# Altium schematic sheet DP&SDI_Arria10.SchDoc: DP & SDI
size B; DocumentNumber: 22; SheetNumber: 22; SheetTotal: 46
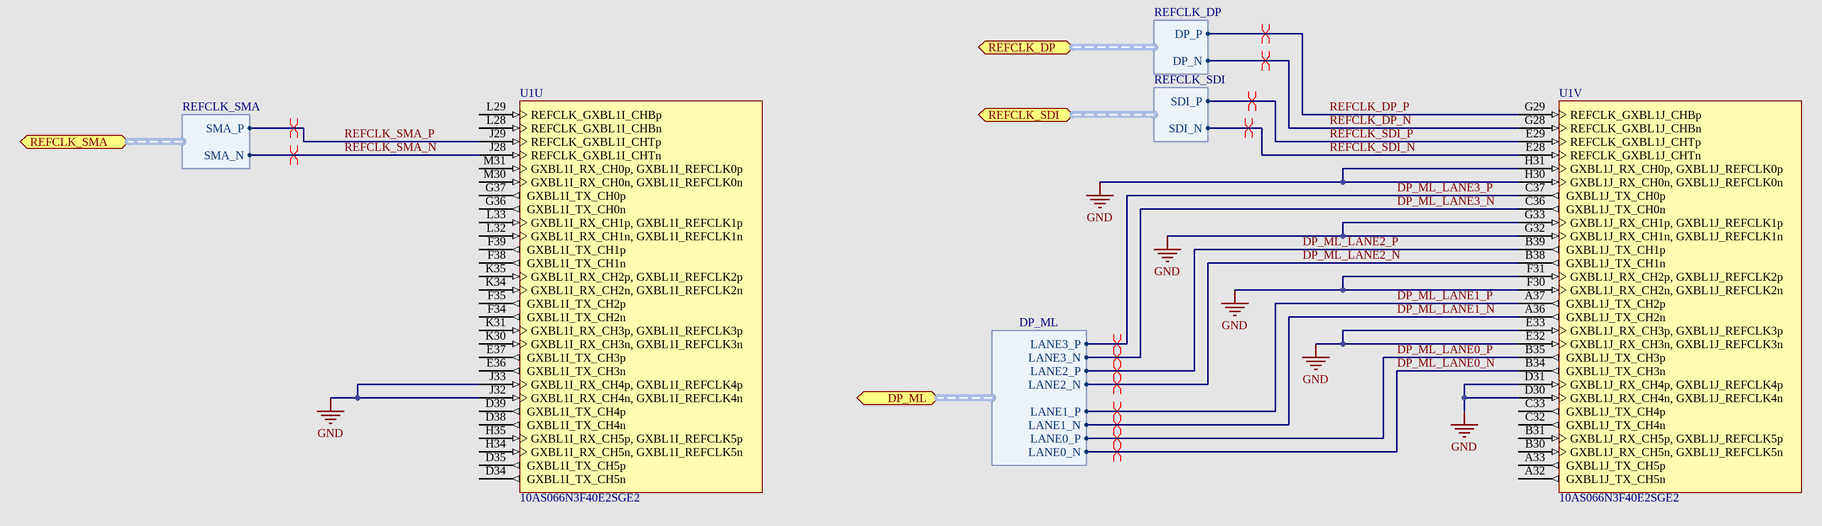
[diagram p0: DP&SDI_Arria10.SchDoc]

## Parts
U1  10AS066N3F40E2SGE2  [ALTR-FBGA1517_A-350]  (parts U,V of 31)

## Ports
DP_ML (harness DP_ML), REFCLK_DP (harness REFCLK_DP), REFCLK_SDI (harness REFCLK_SDI), REFCLK_SMA (harness REFCLK_SMA)

## Harnesses
REFCLK_SMA: SMA_P, SMA_N
REFCLK_DP: DP_P, DP_N
REFCLK_SDI: SDI_P, SDI_N
DP_ML: LANE2_N, LANE2_P, LANE3_N, LANE3_P, LANE1_P, LANE1_N, LANE0_P, LANE0_N

## Nets
GND: U1.D30(GXBL1J_RX_CH4n,_GXBL1J_REFCLK4n) U1.D31(GXBL1J_RX_CH4p,_GXBL1J_REFCLK4p) U1.E32(GXBL1J_RX_CH3n,_GXBL1J_REFCLK3n) U1.E33(GXBL1J_RX_CH3p,_GXBL1J_REFCLK3p) U1.F30(GXBL1J_RX_CH2n,_GXBL1J_REFCLK2n) U1.F31(GXBL1J_RX_CH2p,_GXBL1J_REFCLK2p) U1.G32(GXBL1J_RX_CH1n,_GXBL1J_REFCLK1n) U1.G33(GXBL1J_RX_CH1p,_GXBL1J_REFCLK1p) U1.H30(GXBL1J_RX_CH0n,_GXBL1J_REFCLK0n) U1.H31(GXBL1J_RX_CH0p,_GXBL1J_REFCLK0p) U1.J32(GXBL1I_RX_CH4n,_GXBL1I_REFCLK4n) U1.J33(GXBL1I_RX_CH4p,_GXBL1I_REFCLK4p)
DP_ML_LANE0_N: U1.B34(GXBL1J_TX_CH3n) ; port DP_ML.LANE0_N
DP_ML_LANE0_P: U1.B35(GXBL1J_TX_CH3p) ; port DP_ML.LANE0_P
DP_ML_LANE1_N: U1.A36(GXBL1J_TX_CH2n) ; port DP_ML.LANE1_N
DP_ML_LANE1_P: U1.A37(GXBL1J_TX_CH2p) ; port DP_ML.LANE1_P
DP_ML_LANE2_N: U1.B38(GXBL1J_TX_CH1n) ; port DP_ML.LANE2_N
DP_ML_LANE2_P: U1.B39(GXBL1J_TX_CH1p) ; port DP_ML.LANE2_P
DP_ML_LANE3_N: U1.C36(GXBL1J_TX_CH0n) ; port DP_ML.LANE3_N
DP_ML_LANE3_P: U1.C37(GXBL1J_TX_CH0p) ; port DP_ML.LANE3_P
REFCLK_DP_N: U1.G28(REFCLK_GXBL1J_CHBn) ; port REFCLK_DP.DP_N
REFCLK_DP_P: U1.G29(REFCLK_GXBL1J_CHBp) ; port REFCLK_DP.DP_P
REFCLK_SDI_N: U1.E28(REFCLK_GXBL1J_CHTn) ; port REFCLK_SDI.SDI_N
REFCLK_SDI_P: U1.E29(REFCLK_GXBL1J_CHTp) ; port REFCLK_SDI.SDI_P
REFCLK_SMA_N: U1.J28(REFCLK_GXBL1I_CHTn) ; port REFCLK_SMA.SMA_N
REFCLK_SMA_P: U1.J29(REFCLK_GXBL1I_CHTp) ; port REFCLK_SMA.SMA_P

Not connected (* = marked no-connect by the designer): U1 A32(GXBL1J_TX_CH5n) A33(GXBL1J_TX_CH5p) B30(GXBL1J_RX_CH5n,_GXBL1J_REFCLK5n) B31(GXBL1J_RX_CH5p,_GXBL1J_REFCLK5p) C32(GXBL1J_TX_CH4n) C33(GXBL1J_TX_CH4p) D34(GXBL1I_TX_CH5n) D35(GXBL1I_TX_CH5p) D38(GXBL1I_TX_CH4n) D39(GXBL1I_TX_CH4p) E36(GXBL1I_TX_CH3n) E37(GXBL1I_TX_CH3p) F34(GXBL1I_TX_CH2n) F35(GXBL1I_TX_CH2p) F38(GXBL1I_TX_CH1n) F39(GXBL1I_TX_CH1p) G36(GXBL1I_TX_CH0n) G37(GXBL1I_TX_CH0p) H34(GXBL1I_RX_CH5n,_GXBL1I_REFCLK5n) H35(GXBL1I_RX_CH5p,_GXBL1I_REFCLK5p) K30(GXBL1I_RX_CH3n,_GXBL1I_REFCLK3n) K31(GXBL1I_RX_CH3p,_GXBL1I_REFCLK3p) K34(GXBL1I_RX_CH2n,_GXBL1I_REFCLK2n) K35(GXBL1I_RX_CH2p,_GXBL1I_REFCLK2p) L28(REFCLK_GXBL1I_CHBn) L29(REFCLK_GXBL1I_CHBp) L32(GXBL1I_RX_CH1n,_GXBL1I_REFCLK1n) L33(GXBL1I_RX_CH1p,_GXBL1I_REFCLK1p) M30(GXBL1I_RX_CH0n,_GXBL1I_REFCLK0n) M31(GXBL1I_RX_CH0p,_GXBL1I_REFCLK0p)

## Layout directives
differential pair: DP_ML_LANE0_N, DP_ML_LANE0_P, DP_ML_LANE1_N, DP_ML_LANE1_P, DP_ML_LANE2_N, DP_ML_LANE2_P, DP_ML_LANE3_N, DP_ML_LANE3_P, REFCLK_DP_N, REFCLK_DP_P, REFCLK_SDI_N, REFCLK_SDI_P, REFCLK_SMA_N, REFCLK_SMA_P

## Notes on the sheet
- Title
- Size:
- Date:
- B
- Number:
- Time:
- Revision:
- Sheet
- of
- File:

## Library data of the parts
U1 = CMP-1689-00006-3: Arria 10 SX Family, 588 I/O Pins, 16 Fractional PLLs, 1517-Pin FBGA, Speed Grade 2, Extended Grade, RoHS; ComponentLink3Description: Package Specification; PackageVersion: Rev. 5.0, 01/2016; ComponentLink3URL: https://www.altera.com/content/dam/altera-www/global/en_US/pdfs/literature/packaging/04r00461-04.pdf; ComponentLink2Description: Datasheet; Code_JEDEC: MS-034; Mounting Technology: Surface Mount; PartNumber: 10AS066N3F40E2SGE2; PackageDescription: 1517-Pin FineLine Ball-Grid Array (FBGA), Body 40 x 40 mm, Pitch 1 mm; ComponentLink2URL: https://www.altera.com/content/dam/altera-www/global/en_US/pdfs/literature/hb/arria-10/a10_datasheet.pdf; ComponentLink1URL: https://www.altera.com/; DatasheetVersion: Rev. 2016-06-24, 06/2016; ComponentLink1Description: Manufacturer URL